# Altium schematic sheet LTEW_Power_Supply.SchDoc: LTEW_Power_Supply
size A4; Author: Tristan Traiber; CompanyName: MSE HES-SO; DrawnBy: Tristan Traiber; Engineer: Tristan Traiber; Organization: MSE HES-SO; Address1: HEVS; Address3: Tristan Traiber; DocumentNumber: 3; Revision: 1.0; SheetNumber: 3; SheetTotal: 6
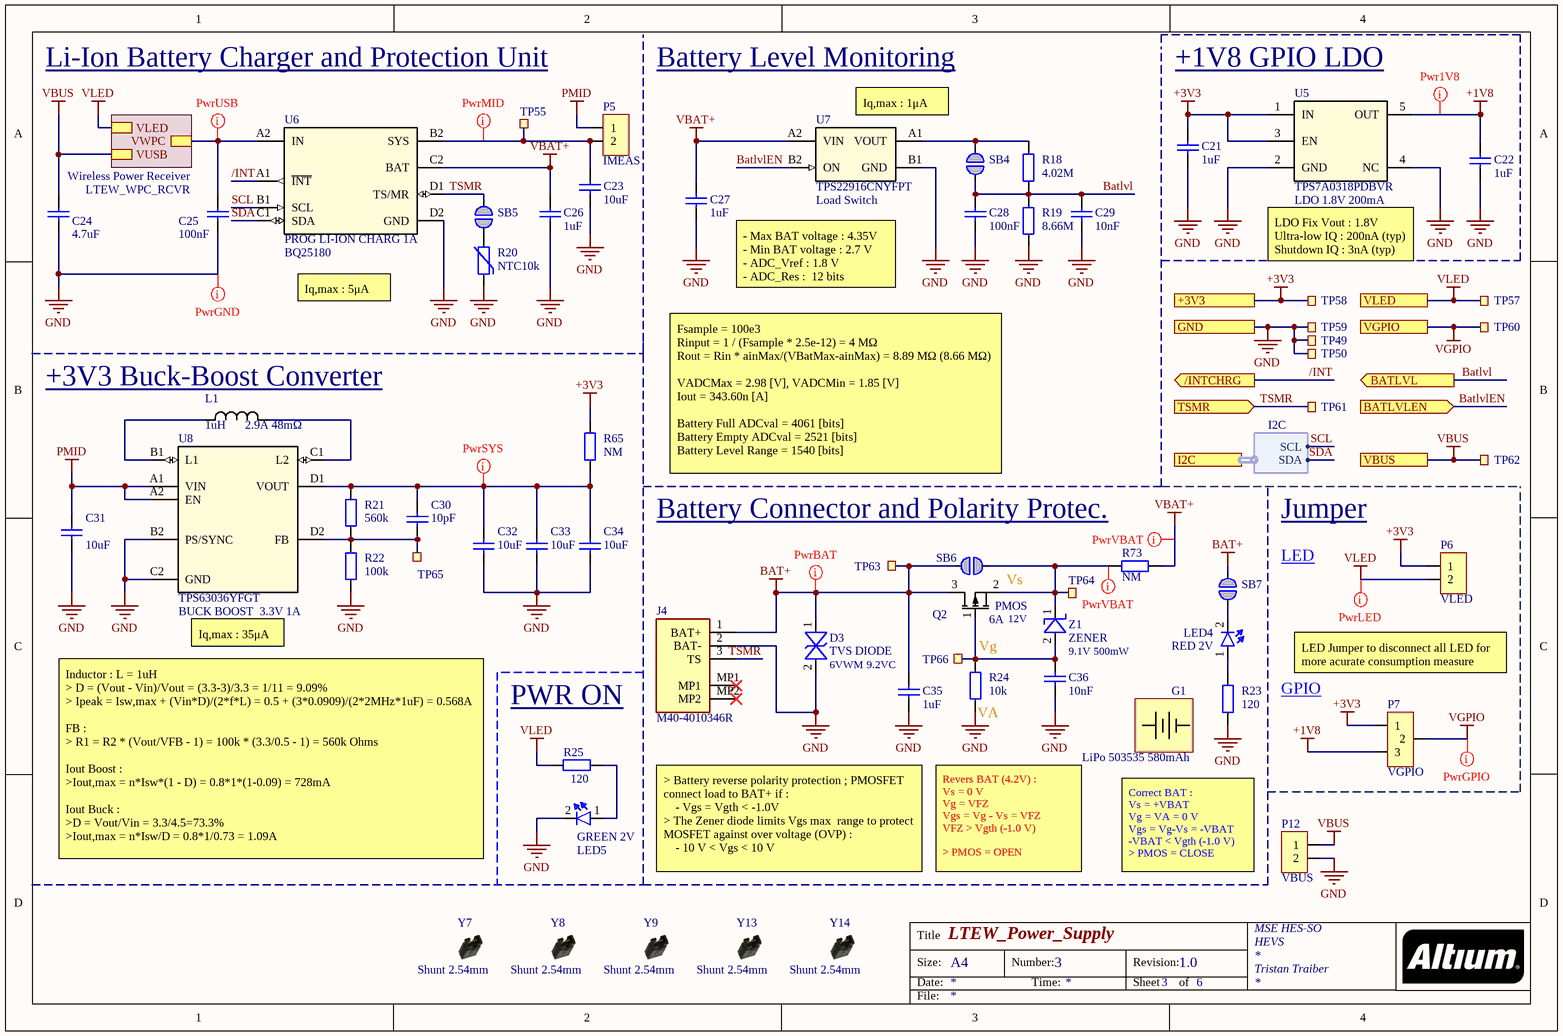
[diagram p0: LTEW_Power_Supply.SchDoc]

## Parts
C21  1uF  [C0603]
C22  1uF  [C0603]
C23  10uF  [C0603]
C24  4.7uF  [C0603]
C25  100nF  [C0603]
C26  1uF  [C0603]
C27  1uF  [C0603]
C28  100nF  [C0603]
C29  10nF  [C0603]
C30  10pF  [C0603]
C31  10uF  [C0603]
C32  10uF  [C0603]
C33  10uF  [C0603]
C34  10uF  [C0603]
C35  1uF  [C0603]
C36  10nF  [C0603]
D3  TVS DIODE  value 6VWM 9.2VC  [SP100701ETG]
G1  LiPo 503535 580mAh  [Battery_Lipo_503535]
J4  M40-4010346R  [M404010346R]
L1  2.9A 48mΩ  value 1uH  [1286ASH1R0MP2]
LED4  RED 2V  [LEDC1608X80N]
LED5  GREEN 2V  [LEDC1608X80N]
P5  IMEAS  [HDR1X2 - IMEAS]
P6  VLED  [HDR1X2 - VLED]
P7  VGPIO  [HDR1X3 - VGPIO]
P12  VBUS  [HDR1X2 - VIN]
Q2  PMOS  value 12V  Value2: 6A  [SSM3J332RLFT]
R18  4.02M  [RES0603]
R19  8.66M  [RES0603]
R20  NTC10k  [C0603]
R21  560k  [RES0603]
R22  100k  [RES0603]
R23  120  [RES0603]
R24  10k  [RES0603]
R25  120  [RES0603]
R65  NM  [RES0603]
R73  NM  [RES0603]
SB4  Solderbridge  [Solderbridge]  (value not drawn)  (no BOM)
SB5  Solderbridge  [Solderbridge]  (value not drawn)  (no BOM)
SB6  Solderbridge  [Solderbridge]  (value not drawn)  (no BOM)
SB7  Solderbridge  [Solderbridge]  (value not drawn)  (no BOM)
TP49  Ø1.0mm,SMD  [TP_SMD_Ø0.8mm]  (value not drawn)  (no BOM)
TP50  Ø1.0mm,SMD  [TP_SMD_Ø0.8mm]  (value not drawn)  (no BOM)
TP55  Ø1.0mm,SMD  [TP_SMD_Ø0.8mm]  (value not drawn)  (no BOM)
TP57  Ø1.0mm,SMD  [TP_SMD_Ø0.8mm]  (value not drawn)  (no BOM)
TP58  Ø1.0mm,SMD  [TP_SMD_Ø0.8mm]  (value not drawn)  (no BOM)
TP59  Ø1.0mm,SMD  [TP_SMD_Ø0.8mm]  (value not drawn)  (no BOM)
TP60  Ø1.0mm,SMD  [TP_SMD_Ø0.8mm]  (value not drawn)  (no BOM)
TP61  Ø1.0mm,SMD  [TP_SMD_Ø0.8mm]  (value not drawn)  (no BOM)
TP62  Ø1.0mm,SMD  [TP_SMD_Ø0.8mm]  (value not drawn)  (no BOM)
TP63  Ø1.0mm,SMD  [TP_SMD_Ø0.8mm]  (value not drawn)  (no BOM)
TP64  Ø1.0mm,SMD  [TP_SMD_Ø0.8mm]  (value not drawn)  (no BOM)
TP65  Ø1.0mm,SMD  [TP_SMD_Ø0.8mm]  (value not drawn)  (no BOM)
TP66  Ø1.0mm,SMD  [TP_SMD_Ø0.8mm]  (value not drawn)  (no BOM)
U5  TPS7A0318PDBVR  value LDO 1.8V 200mA  [SOT95P280X145-5N]
U6  BQ25180  value PROG LI-ION CHARG 1A  [BGA8C40P2X4_100X155X50]
U7  TPS22916CNYFPT  value Load Switch  [BGA4C40P2X2_78X78X50]
U8  TPS63036YFGT  value BUCK BOOST  3.3V 1A  [BGA8C40P2X4_108X181X62]
Y7  Shunt 2.54mm  [Shunt_2.54mm_Horizontal]
Y8  Shunt 2.54mm  [Shunt_2.54mm_Horizontal]
Y9  Shunt 2.54mm  [Shunt_2.54mm_Horizontal]
Y13  Shunt 2.54mm  [Shunt_2.54mm_Horizontal]
Y14  Shunt 2.54mm  [Shunt_2.54mm_Horizontal]
Z1  ZENER  value 9.1V 500mW  [SOD3716X145N]

## Sub-sheets
Wireless Power Receiver = LTEW_WPC_RCVR: VWPC, VLED, VUSB

## Ports
+3V3, /INTCHRG (out), BATLVL (out), BATLVLEN (in), GND, I2C (harness I2C), TSMR (in), VBUS, VGPIO, VLED

## Harnesses
I2C: SCL, SDA

## Nets
+1V8: C22.2 P7.3 U5.5(OUT)
+3V3: C21.2 P6.1 P7.1 R65.2 TP58.1 U5.1(IN) U5.3(EN) ; port +3V3
BAT+: C35.2 D3.1 J4.1(BAT+) Q2.3(D) SB6.1 SB7.1 TP63.1
GND: C21.1 C22.1 C23.1 C24.2 C25.1 C26.1 C27.1 C28.1 C29.1 C31.1 C32.1 C33.1 C34.1 C35.1 C36.1 D3.2 J4.2(BAT-) LED5.2(K) P12.2 R19.1 R20.1 R22.1 R23.1 R24.1 TP49.1 TP50.1 TP59.1 U5.2(GND) U5.4(NC) U6.D2(GND) U7.B1(GND) U8.B2(PS/SYNC) U8.C2(GND) ; port GND
PMID: C31.2 P5.1 U8.A1(VIN) U8.A2(EN)
VBAT+: C26.2 C27.2 R73.1 U6.C2(BAT) U7.A2(VIN)
VBUS: C24.1 P12.1 TP62.1 ; port VBUS, sheet Wireless Power Receiver/VUSB
VGPIO: P7.2 TP60.1 ; port VGPIO
VLED: P6.2 R25.1 TP57.1 ; port VLED, sheet Wireless Power Receiver/VLED
/INT: U6.A1(~{INT}) ; port /INTCHRG
Batlvl: C28.2 C29.2 R18.1 R19.2 SB4.2 ; port BATLVL
BatlvlEN: U7.B2(ON) ; port BATLVLEN
SCL: U6.B1(SCL) ; port I2C.SCL
SDA: U6.C1(SDA) ; port I2C.SDA
TSMR: J4.3(TS) SB5.1 TP61.1 U6.D1(TS/MR) ; port TSMR
NetC23_2: C23.2 P5.2 TP55.1 U6.B2(SYS)
NetC25_2: C25.2 U6.A2(IN) ; sheet Wireless Power Receiver/VWPC
NetC30_1: C30.1 R21.1 R22.2 TP65.1 U8.D2(FB)
NetC30_2: C30.2 C32.2 C33.2 C34.2 R21.2 R65.1 U8.D1(VOUT)
NetC36_2: C36.2 Q2.1(G) R24.2 TP66.1 Z1.2(A)
NetL1_1: L1.1 U8.C1(L2)
NetL1_2: L1.2 U8.B1(L1)
NetLED4_1: LED4.1(A) R23.2
NetLED4_2: LED4.2(K) SB7.2
NetLED5_1: LED5.1(A) R25.2
NetQ2_2: Q2.2(S) R73.2 SB6.2 TP64.1 Z1.1(K)
NetR18_2: R18.2 SB4.1 U7.A1(VOUT)
NetR20_2: R20.2 SB5.2

Not connected (* = marked no-connect by the designer): J4 MP1* MP2*

## Layout directives
mark named PwrUSB: NetC25_2
mark named PwrMID: NetC23_2
mark named PwrSYS: NetC30_2
mark named PwrGND: GND
mark named PwrVBAT: NetQ2_2, VBAT+
mark named PwrBAT: BAT+
mark named PwrGPIO: VGPIO
mark named Pwr1V8: +1V8
mark named PwrLED: VLED

## Notes on the sheet
- Li-Ion Battery Charger and Protection Unit
- Battery Level Monitoring
- (near U7) Iq,max : 1μA
- (near U5) +1V8 GPIO LDO
- (near U6) Iq,max : 5μA
- - Max BAT voltage : 4.35V
  - Min BAT voltage : 2.7 V
  - ADC_Vref : 1.8 V
  - ADC_Res :  12 bits
- LDO Fix Vout : 1.8V
  Ultra-low IQ : 200nA (typ)
  Shutdown IQ : 3nA (typ)
- (near L1) +3V3 Buck-Boost Converter
- Fsample = 100e3
  Rinput = 1 / (Fsample * 2.5e-12) = 4 MΩ
  Rout = Rin * ainMax/(VBatMax-ainMax) = 8.89 MΩ (8.66 MΩ)
  VADCMax = 2.98 [V], VADCMin = 1.85 [V]
  Iout = 343.60n [A]
  Battery Full ADCval = 4061 [bits]
  Battery Empty ADCval = 2521 [bits]
  Battery Level Range = 1540 [bits]
- Battery Connector and Polarity Protec.
- Vs
- LED
- Jumper
- (near U8) Iq,max : 35μA
- Vg
- (near R25) PWR ON
- (near R24) VA
- GPIO
- LED Jumper to disconnect all LED for more acurate consumption measure
- Inductor : L = 1uH
  > D = (Vout - Vin)/Vout = (3.3-3)/3.3 = 1/11 = 9.09%
  > Ipeak = Isw,max + (Vin*D)/(2*f*L) = 0.5 + (3*0.0909)/(2*2MHz*1uF) = 0.568A
  FB :
  > R1 = R2 * (Vout/VFB - 1) = 100k * (3.3/0.5 - 1) = 560k Ohms
  Iout Boost :
  >Iout,max = n*Isw*(1 - D) = 0.8*1*(1-0.09) = 728mA
  Iout Buck :
  >D = Vout/Vin = 3.3/4.5=73.3%
  >Iout,max = n*Isw/D = 0.8*1/0.73 = 1.09A
- > Battery reverse polarity protection ; PMOSFET connect load to BAT+ if :
  - Vgs = Vgth < -1.0V
  > The Zener diode limits Vgs max  range to protect MOSFET against over voltage (OVP) :
  - 10 V < Vgs < 10 V
- Revers BAT (4.2V) :
  Vs = 0 V
  Vg = VFZ
  Vgs = Vg - Vs = VFZ
  VFZ > Vgth (-1.0 V)
  > PMOS = OPEN
- Correct BAT :
  Vs = +VBAT
  Vg = VA = 0 V
  Vgs = Vg-Vs = -VBAT
  -VBAT < Vgth (-1.0 V)
  > PMOS = CLOSE
- Title
- Size:
- Date:
- A4
- Number:
- Time:
- Revision:
- Sheet
- of
- File:

## Library data of the parts
C21 C22 C26 C27 C35 = C_1u: 1 µF ±10% 25V Ceramic Capacitor X7R 0603 (1608 Metric); Manufacturer_Part_Number: CL10B105KA8NNNC; Manufacturer_Name: Samsung Electro-Mechanics; Supplier 1: Mouser; Supplier Part Number 1: 187-CL10B105KA8NNNC; Value: 1uF; Price Unit: 0.10
C23 C31-C34 = C_10u: 10 µF ±10% 25V Ceramic Capacitor X5R 0805 (2012 Metric); Manufacturer_Part_Number: GRM188R61E106KA73J; Manufacturer_Name: Murata Electronics; Supplier 1: Mouser; Value: 10uF; Supplier Part Number 1: 81-GRM188R61E106KA3J; Unit Price: 0.280
C24 = C_4.7u: 4.7 µF ±10% 25V Condensateurs céramique X6S 0603 (1608 métrique); Manufacturer_Part_Number: GRM188C81E475KE11D; Manufacturer_Name: Murata Electronics; Supplier 1: Digi-Key; Value: 4.7uF; Supplier Part Number 1: 490-7199-1-ND; Unit Price: 0.24
C25 C28 = C_100n: 0.1 µF ±10% 25V Condensateurs céramique X7R 0603 (1608 métrique); Manufacturer_Part_Number: CL10B104KA8NNNC; Manufacturer_Name: Samsung Electro-Mechanics; Supplier 1: Digi-Key; Value: 100nF; Supplier Part Number 1: 1276-1006-1-ND; Unit Price: 0.10
C29 C36 = C_10n: 10000 pF ±5% 25V Condensateurs céramique C0G, NP0 0603 (1608 métrique); Manufacturer_Part_Number: C1608C0G1E103J080AA; Manufacturer_Name: TDK Corporation; Value: 10nF; Supplier 1: Digi-Key; Supplier Part Number 1: 445-2664-1-ND; Unit Price: 0.270
C30 = C_10p: 10 pF ±5% 50V Ceramic Capacitor C0G, NP0 0603 (1608 Metric); Manufacturer_Part_Number: 06035A100JAT2A; Manufacturer_Name: KYOCERA AVX; Supplier 1: Digi-Key; Value: 10pF; Supplier Part Number 1: 478-1163-1-ND; Unit Price: 0.10
D3 = D_TVS: 9.2V Clamp 5A (8/20µs) Ipp Tvs Diode Surface Mount SOD-882; Manufacturer_Name: LITTELFUSE; Manufacturer_Part_Number: SP1007-01ETG; Datasheet Link: https://www.littelfuse.com/~/media/electronics/datasheets/tvs_diode_arrays/littelfuse_tvs_diode_array_sp1007_datasheet.pdf.pdf; Height: 0.6mm; Supplier 1: Digi-Key; Supplier Part Number 1: F6187CT-ND; Unit Price: 0.40
G1 = Battery: 503535 3.8v 580mAh round lipo battery cells / (Order : shorturl.at/tEFMZ); ComponentLink1Description: Order; ComponentLink1URL: https://batteryzone.de/products/503535-580mah-hochspannung-3-8v-runde-polymer-smart-watch-moxibustion-instrument-auto-smart-box-batterie?_pos=1&_sid=59cfd2d74&_ss=r; Value: LiPo 503535 580mAh; Manufacturer_Name: -; Manufacturer_Part_Number: https://batteryzone.de/products/503535-580mah-hochspannung-3-8v-runde-polymer-smart-watch-moxibustion-instrument-auto-smart-box-batterie?_pos=1&_sid=59cfd2d74&_ss=r; Supplier Part Number 1: https://batteryzone.de/products/503535-580mah-hochspannung-3-8v-runde-polymer-smart-watch-moxibustion-instrument-auto-smart-box-batterie?_pos=1&_sid=59cfd2d74&_ss=r; Unit Price: 12.50
J4 = CON_BAT_3POS: Connector Header Surface Mount, Right Angle 3 position 0.039" (1.00mm); Manufacturer_Name: Harwin; Datasheet Link: https://cdn.harwin.com/pdfs/M40-401.pdf; Height: 3.25mm; Manufacturer_Part_Number: M40-4010346R; Mouser Part Number: 855-M40-4010346R; Mouser Price/Stock: https://www.mouser.co.uk/ProductDetail/Harwin/M40-4010346R?qs=ulE8k0yEMYbY8tNiZulTaA%3D%3D; Supplier 1: Digi-Key; Supplier Part Number 1: M40-4010346R-ND
L1 = L_1u: 1 µH Shielded Drum Core, Wirewound Inductor 2.9 A 48mOhm Max 0806 (2016 Metric); Manufacturer_Part_Number: DFE201612E-1R0M=P2; Manufacturer_Name: Murata Electronics; Copyright: Copyright (C) 2022 Ultra Librarian. All rights reserved.; Supplier 1: Digi-Key; Supplier Part Number 1: 490-16593-1-ND; Unit Price: 0.35
LED4 = LED_R: Red 625nm LED Indication - Discrete 2V 0603 (1608 Metric); Manufacturer_Name: QT Brightek (QTB); Manufacturer_Part_Number: 150060RS75000; Datasheet Link: http://www.qt-brightek.com/datasheet/QBLP617_series.pdf; Height: 1.3mm; Supplier 1: Digi-Key; Supplier Part Number 1: 732-4978-1-ND; Unit Price: 0.15
LED5 = LED_G: Green 570nm LED Indication - Discrete 2V 0603 (1608 Metric); Manufacturer_Name: QT Brightek (QTB); Manufacturer_Part_Number: 150060VS75000; Datasheet Link: http://www.qt-brightek.com/datasheet/QBLP617_series.pdf; Height: 1.3mm; Supplier 1: Digi-Key; Supplier Part Number 1: 732-4980-1-ND; Unit Price: 0.15
P5 P6 P12 = H_2POS: Header, 2-Pin; Manufacturer_Part_Number: 10129378-902001BLF; Manufacturer_Name: Amphenol ICC (FCI); Supplier 1: Mouser; Supplier Part Number 1: 649-1012937890201BLF; Unit Price: 0.10
P7 = H_3POS: Header, 3-Pin; Manufacturer_Name: Harwin Inc.; Manufacturer_Part_Number: M20-9990345; Supplier 1: Digi-key; Supplier Part Number 1: 952-2263-ND; Unit Price: 0.17
Q2 = MOS-P: P-Channel 12 V 6A (Ta) 1W (Ta) Surface Mount SOT-23F; Manufacturer_Name: Toshiba; Manufacturer_Part_Number: SSM3J338R; Datasheet Link: http://toshiba.semicon-storage.com/info/docget.jsp?did=30384&prodName=SSM3J338R; Supplier 1: Digi-Key; Supplier Part Number 1: SSM3J338RLFCT-ND; Unit Price: 0.38
R18 = R_4M: 4.02 MOhms ±1% 0,1W, 1/10W Pavé résistif 0603 (1608 métrique) Résistant à l’humidité Couche épaisse; Manufacturer_Part_Number: RC0603FR-074M02L; Manufacturer_Name: YAGEO; Value: 4.02M; Supplier 1: Digi-Key; Supplier Part Number 1: YAG5698CT-ND; Unit Price: 0.10
R19 R65 R73 = R_8.66M: 8.66 MOhms ±1% 0,1W, 1/10W Pavé résistif 0603 (1608 métrique) AutomobileAEC-Q200 Couche épaisse; Manufacturer_Part_Number: CRCW06038M66FKEA; Manufacturer_Name: YAGEO; Supplier 1: Digi-Key; Supplier Part Number 1: 541-8.66MHCT-ND; Unit Price: 0.10
  R19: Value: 8.66M
  R65 R73: Value: NM
R20 = R_NTC_10k: NTC Thermistor 10k 0603 (1608 Metric); Manufacturer_Part_Number: ERT-J1VR103J; Manufacturer_Name: Panasonic; Value: NTC10k; Supplier 1: Digi-Key; Supplier Part Number 1: P10547CT-ND; Unit Price: 0.18
R21 = R_560k: 560 kOhms ±1% 0.1W, 1/10W Chip Resistor 0603 (1608 Metric) Automotive AEC-Q200, Moisture Resistant Thick Film; Manufacturer_Part_Number: AC0603FR-07560KL; Manufacturer_Name: YAGEO; Value: 560k; Supplier 1: Digi-Key; Supplier Part Number 1: 311-560KLDCT-ND; Unit Price: 0.10
R22 = R_100k: RES SMD 100K OHM 1% 1/8W 0603; Manufacturer_Part_Number: RC0805FR-07100KL; Manufacturer_Name: YAGEO; Supplier 1: Digi-Key; Supplier Part Number 1: 311-100KCRCT-ND; Value: 100k; Unit Price: 0.10
R23 R25 = R_120: 1 MOhms ±1% 0.1W, 1/10W Chip Resistor 0603 (1608 Metric) Automotive AEC-Q200 Thick Film; Manufacturer_Part_Number: CRGCQ0603F120R; Manufacturer_Name: YAGEO; Value: 120; Supplier 1: Digi-Key; Supplier Part Number 1: A129677CT-ND; Unit Price: 0.10
R24 = R_10k: 10 kOhms ±1% 0.1W, 1/10W Chip Resistor 0603 (1608 Metric) Moisture Resistant Thick Film; Manufacturer_Part_Number: RC0805FR-0710KL; Manufacturer_Name: YAGEO; Value: 10k; Supplier 1: Digi-Key; Supplier Part Number 1: 311-10.0KHRCT-ND; Unit Price: 0..10
SB4-SB7 = Solderbridge: Manufacturer: N.A.; Pad Count: 2; Part Number: Solderbridge; Manufacturer Part Number: N.A.; LatestRevisionDate: 2009-12-14; Published: 2009-12-14; Value: Solderbridge; Note: N.A.; Artikkelnr Noca: N.A.; Footprint Doc: Solderbridge; Part number IPS: N.A.; ComponentLink1URL: N.A.; ComponentLink1Description: Datasheet; ComponentLink2URL: N.A.; ComponentLink2Description: Supplier link; HelpURL: N.A.; Supplier 1: N.A.; Supplier Part Number 1: N.A.; Supplier 2: N.A.; Supplier Part Number 2: N.A.; PartId: 100500458; Component Class: Connectors
TP49 TP50 TP55 TP57-TP66 = TP_SMD: 0.8 mm circular SMD testpad; Part Number: TP_SMD_Ø1.0MM; Manufacturer: Nordic Semiconductor; Manufacturer Part Number: N.A.; Pad Count: 1; ComponentLink1URL: N.A.; ComponentLink1Description: Datasheet; ComponentLink2URL: N.A.; ComponentLink2Description: Supplier link; HelpURL: N.A.; Footprint Doc: TP_SMD_Ø1.0mm; LatestRevisionDate: 2013-06-11; Published: 2013-06-11; Value: Ø1.0mm,SMD; Note: N.A.; Supplier 1: N.A.; Supplier Part Number 1: N.A.; Supplier 2: N.A.; Supplier Part Number 2: N.A.; Artikkelnr Noca: N.A.; Part number IPS: N.A.; PartId: 100500475; Component Class: Connectors
U5 = IC_TPS7A0318PDBVR: Linear Voltage Regulator IC Positive Fixed 1 Output 200mA SOT-23-5; Manufacturer_Part_Number: TPS7A0312PDBVR; Manufacturer_Name: Texas Instruments; Type: DEV; Supplier 1: Digi-Key; Copyright: Copyright (C) 2022 Ultra Librarian. All rights reserved.; Supplier Part Number 1: 296-TPS7A0318PDBVRCT-ND; Unit Price: 0.93
U6 = IC_BQ25180YBGT: Charger IC Lithium Ion/Polymer, Lithium Iron Phosphate 8-DSBGA; Manufacturer_Part_Number: BQ25180YBGR; Manufacturer_Name: Texas Instruments; Type: DEV; Copyright: Copyright (C) 2022 Ultra Librarian. All rights reserved.; Supplier 1: Mouser; Supplier Part Number 1: 595-BQ25180YBGR; Unit Price: 2.75
U7 = SW_LOAD_SW: Power Switch/Driver 1:1 P-Channel 2A 4-DSBGA; Manufacturer_Name: Texas Instruments; Type: DEV; RefDes: RefDes; Copyright: Copyright (C) 2022 Ultra Librarian. All rights reserved.; Manufacturer_Part_Number: TPS22916CNYFPT; Supplier 1: Mouser; Supplier Part Number 1: 595-TPS22916CNYFPT; Unit Price: 1.22
U8 = IC_TPS63036YFGT: Buck-Boost Switching Regulator IC Positive Adjustable 1.2V 1 Output 1A (Switch) 8-UFBGA, DSBGA; Mfr_Name: Texas Instruments; Copyright: Copyright (C) 2022 Ultra Librarian. All rights reserved.; Supplier 1: Mouser; Supplier Part Number 1: 595-TPS63036YFGT; Manufacturer_Part_Number: TPS63036YFGT; Unit Price: 2.69
Y7-Y9 Y13 Y14 = SHUNT JUMPER 2.54mm BLACK GOLD Horizontal: Shunt Jumper 2.54mm Black; Manufacturer Part Number: SPC02SYAN; Manufacturer_Name: Sullins Connector Solutions; ComponentLink1URL: N.A.; ComponentLink1Description: Datasheet; ComponentLink2URL: N.A.; ComponentLink2Description: Supplier link; Footprint Doc: SHUNT JUMPER 2.54mm; Value: Shunt 2.54mm; Component Class: Connectors; Supplier 1: Digi-Key; Supplier Part Number 1: S9001-ND; Unit Price: 0.10
Z1 = D_ZENER_9V1: Zener Diode 9.1 V 500 mW ±6% Surface Mount SOD-123; Manufacturer_Name: Diodes Inc.; Manufacturer_Part_Number: BZT52C9V1S-7-F; Datasheet Link: https://www.diodes.com/assets/Datasheets/ds18004.pdf; Height: 1.45mm; Supplier 1: Digi-Key; Supplier Part Number 1: BZT52C9V1-FDICT-ND; Unit Price: 0.30